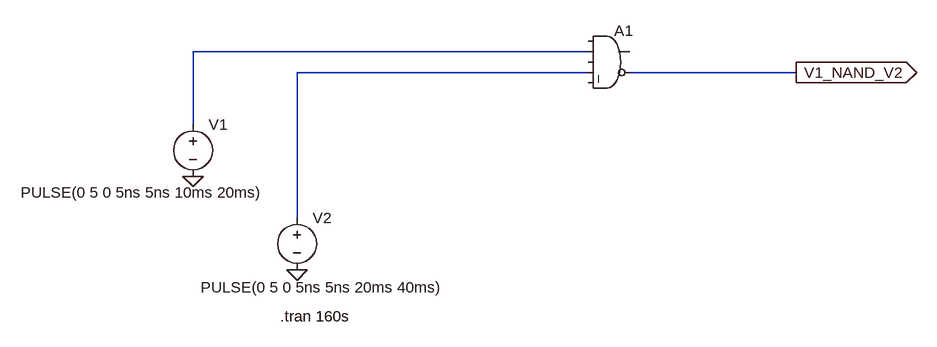
[diagram p0: schematic Nand gate.asc]
Nand gate.asc, the LTspice schematic file:
Version 4
SHEET 1 1096 680
WIRE 560 -48 -48 -48
WIRE 560 -16 112 -16
WIRE 880 -16 624 -16
WIRE -48 64 -48 -48
WIRE 112 208 112 -16
FLAG 112 288 0
FLAG -48 144 0
FLAG 880 -16 V1_NAND_V2
IOPIN 880 -16 Out
SYMBOL voltage -48 48 R0
WINDOW 3 -265 121 Left 2
WINDOW 123 0 0 Left 0
WINDOW 39 0 0 Left 0
SYMATTR InstName V1
SYMATTR Value PULSE(0 5 0 5ns 5ns 10ms 20ms)
SYMBOL voltage 112 192 R0
WINDOW 3 -148 123 Left 2
WINDOW 123 0 0 Left 0
WINDOW 39 0 0 Left 0
SYMATTR InstName V2
SYMATTR Value PULSE(0 5 0 5ns 5ns 20ms 40ms)
SYMBOL Digital\\and 592 -96 R0
SYMATTR InstName A1
TEXT 86 360 Left 2 !.tran 160s

The netlist it stands for:
* Nand gate.asc
V1 N001 0 PULSE(0 5 0 5ns 5ns 10ms 20ms)
V2 N002 0 PULSE(0 5 0 5ns 5ns 20ms 40ms)
A1 0 N001 0 N002 0 V1_NAND_V2 0 0 AND
.tran 160s
.backanno
.end